# EAGLE schematic IV-18_test (EAGLE 6.4)
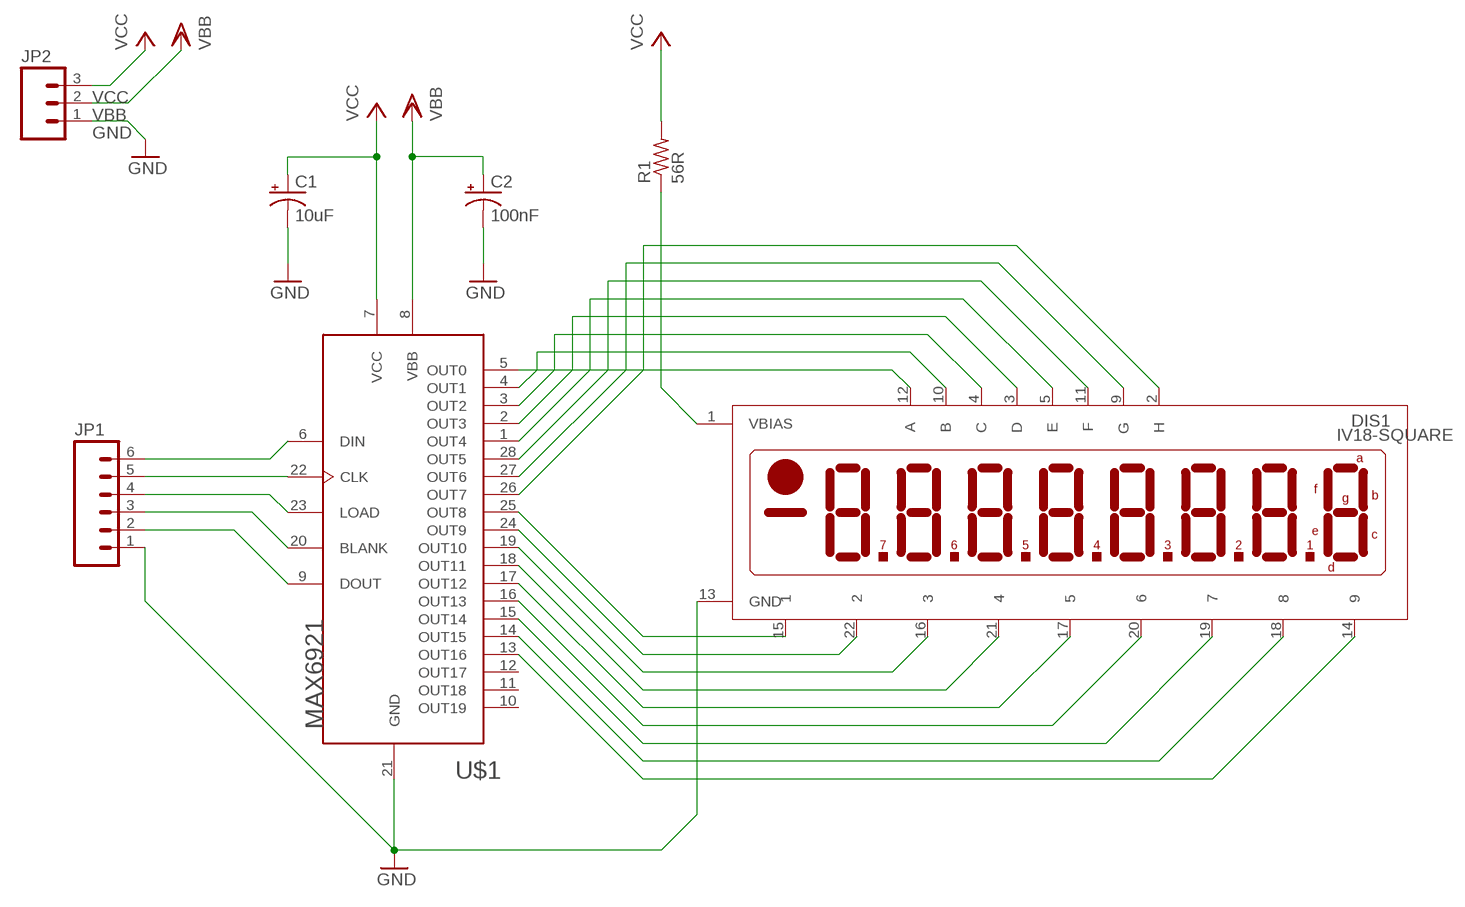
[diagram p0: schematic, sheet 1]

## Parts
C1  10uF  CPOL-USE2-5  [E2-5]
C2  100nF  CPOL-USE2-5  [E2-5]
DIS1  IV18-SQUARE  [IV-18_SQUARE]
JP1  M06LONGPADS  [1X06_LONGPADS]
JP2  M03LONGPADS  [1X03_LONGPADS]
R1  56R  R-US_0207/10  [0207/10]
U$1  MAX6921AUI  MAX6921AUI"  [TSSOP28]

## Nets
GND: C1.- C2.- DIS1.13(GND) JP1.1 JP2.1 U$1.21(GND)
N$1: DIS1.12(A) U$1.5(OUT0)
N$2: DIS1.10(B) U$1.4(OUT1)
N$3: DIS1.4(C) U$1.3(OUT2)
N$4: DIS1.3(D) U$1.2(OUT3)
N$5: DIS1.5(E) U$1.1(OUT4)
N$6: DIS1.11(F) U$1.28(OUT5)
N$7: DIS1.9(G) U$1.27(OUT6)
N$8: DIS1.2(H) U$1.26(OUT7)
N$9: DIS1.15 U$1.25(OUT8)
N$10: DIS1.22 U$1.24(OUT9)
N$11: DIS1.16 U$1.19(OUT10)
N$12: DIS1.21 U$1.18(OUT11)
N$13: DIS1.17 U$1.17(OUT12)
N$14: DIS1.20 U$1.16(OUT13)
N$15: DIS1.19 U$1.15(OUT14)
N$16: DIS1.18 U$1.14(OUT15)
N$17: DIS1.14 U$1.13(OUT16)
N$18: JP1.6 U$1.6(DIN)
N$19: JP1.5 U$1.22(CLK)
N$20: JP1.4 U$1.23(LOAD)
N$21: JP1.3 U$1.20(BLANK)
N$22: JP1.2 U$1.9(DOUT)
VBB: C2.+ JP2.2 U$1.8(VBB)
VBIAS: DIS1.1(VBIAS) R1.1
VCC: C1.+ JP2.3 R1.2 U$1.7(VCC)
Unconnected: U$1.10(OUT19) U$1.11(OUT18) U$1.12(OUT17)

## Library data of the parts
C1 C2 = iStivi - RCLD:CPOL-US: POLARIZED CAPACITOR, American symbol
DIS1 = iStivi - Tubes:IV18: VFD Display 8-character 7 segment
JP1 = iStivi - Header-Connector:M06: Header 6 Standard 6-pin 0.1" header. Use with straight break away headers (SKU : PRT-00116), right angle break away headers (PRT-00553), swiss pins (PRT-00743), machine pins (PRT-00117), and female headers (PRT-00115). Molex polarized connector foot print use with SKU : PRT-08094 with associated crimp pins and housings. NOTES ON THE VARIANTS LOCK and LOCK_LONGPADS... This footprint was designed to help hold the alignment of a through-hole component (i.e. 6-pin header) while soldering it into place. You may notice that each hole has been shifted either up or down by 0.005 of an inch from it's more standard position (which is a perfectly straight line). This slight alteration caused the pins (the squares in the middle) to touch the edges of the holes. Because they are alternating, it causes a "brace" to hold the component in place. 0.005 has proven to be the perfect amount of "off-center" position when using our standard breakaway headers. Although looks a little odd when you look at the bare footprint, once you have a header in there, the alteration is very hard to notice. Also, if you push a header all the way into place, it is covered up entirely on the bottom side. This idea of altering the position of holes to aid alignment will be further integrated into the Sparkfun Library for other footprints. It can help hold any component with 3 or more connection pins.
JP2 = iStivi - Header-Connector:M03: Header 3 Standard 3-pin 0.1" header. Use with straight break away headers (SKU : PRT-00116), right angle break away headers (PRT-00553), swiss pins (PRT-00743), machine pins (PRT-00117), and female headers (PRT-00115). Molex polarized connector foot print use with SKU : PRT-08232 with associated crimp pins and housings.
R1 = iStivi - RCLD:R-US_: RESISTOR, American symbol
U$1 = iStivi - ICs:MAX6921: MAX6921 76V VFD driver in TSSOP and PLCC. Can be cascaded, talk to it via SPI